# EAGLE design MITCH_2021-0_SHIELD (EAGLE 9.6.2)
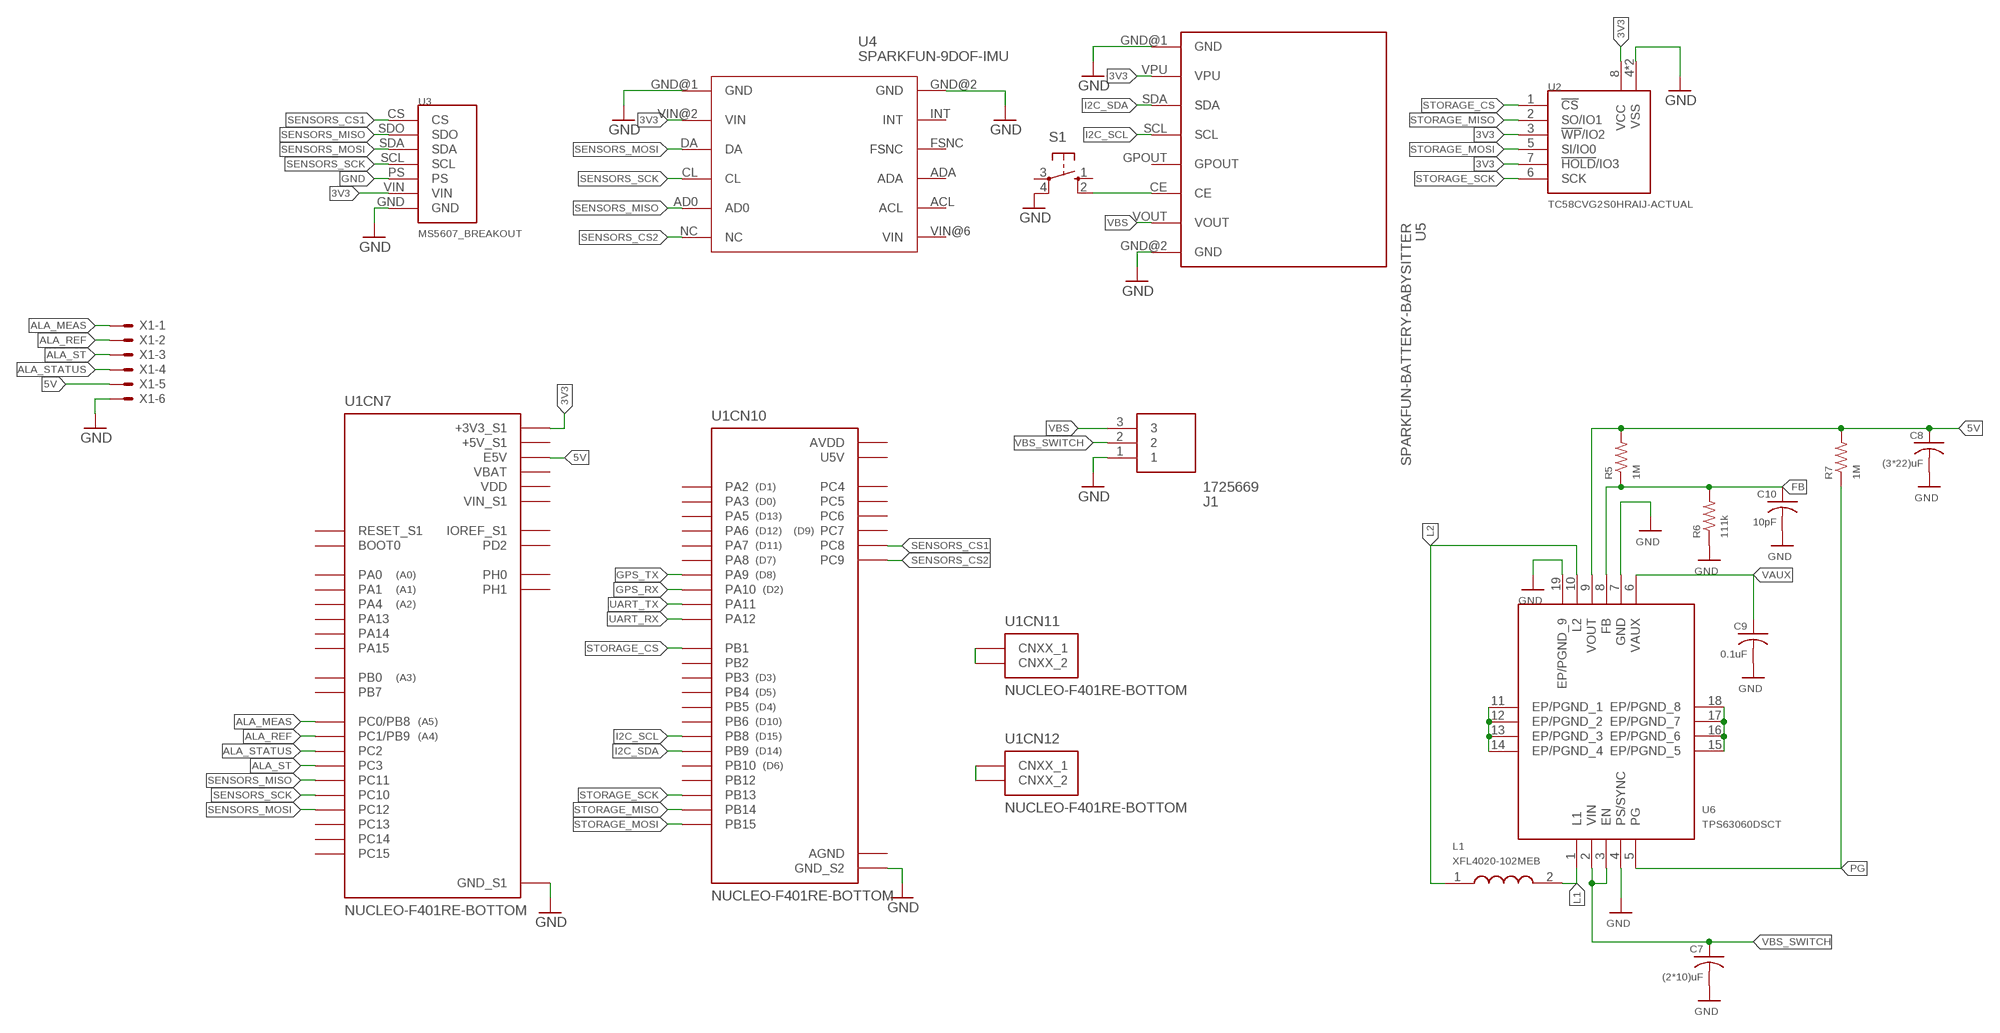
[diagram p0: schematic, sheet 1]

## Parts
C7  (2*10)uF  C-USC0805  [C0805]
C8  (3*22)uF  C-USC0805  [C0805]
C9  0.1uF  C-USC0805  [C0805]
C10  10pF  C-USC0805  [C0805]
J1  1725669  [1725669]
L1  XFL4020-102MEB  [XFL4020102MEB]
R5  1M  R-US_R0805  [R0805]
R6  111k  R-US_R0805  [R0805]
R7  1M  R-US_R0805  [R0805]
S1  10-XX  [B3F-10XX]
U1  NUCLEO-F401RE-BOTTOM  [ST_NUCLEO-F401RE_BOTTOM]
U2  TC58CVG2S0HRAIJ-ACTUAL  [COMPUTER2_SON127P800X600X80-9T350X440N]
U3  MS5607_BREAKOUT  [MS5607_BREAKOUT]
U4  SPARKFUN-9DOF-IMU  [SPARKFUN-9DOF-IMU1]
U5  SPARKFUN-BATTERY-BABYSITTER  [SPARKFUN-BATTERY-BABYSITTER]
U6  TPS63060DSCT  [TPS63060DSCT]
X1  22-23-2061  [22-23-2061]

## Nets
3V3: U1.CN7_16(CN7:+3V3_S1) U2.3(!WP!/IO2) U2.7(!HOLD!/IO3) U2.8(VCC) U3.VIN U4.VIN@2(VIN) U5.VPU
5V: C8.1 R5.2 R7.2 U1.CN7_6(CN7:E5V) U6.9(VOUT) X1.5
ALA_MEAS: U1.CN7_38(CN7:PC0/PB8) X1.1
ALA_REF: U1.CN7_36(CN7:PC1/PB9) X1.2
ALA_ST: U1.CN7_37(CN7:PC3) X1.3
ALA_STATUS: U1.CN7_35(CN7:PC2) X1.4
FB: C10.1 R5.1 R6.2 U6.8(FB)
GND: C7.2 C8.2 C9.2 C10.2 J1.1 R6.1 S1.4(P1) U1.CN7_8(CN7:GND_S1) U1.CN7_19(CN7:GND_S1) U1.CN7_20(CN7:GND_S1) U1.CN7_22(CN7:GND_S1) U1.CN10_9(CN10:GND_S2) U1.CN10_20(CN10:GND_S2) U2.4(VSS) U2.9(VSS) U3.GND U3.PS U4.GND@1(GND) U4.GND@2(GND) U5.GND@1(GND) U5.GND@2(GND) U6.4(PS/SYNC) U6.7(GND) U6.11(EP/PGND_1) U6.12(EP/PGND_2) U6.13(EP/PGND_3) U6.14(EP/PGND_4) U6.15(EP/PGND_5) U6.16(EP/PGND_6) U6.17(EP/PGND_7) U6.18(EP/PGND_8) U6.19(EP/PGND_9) X1.6
GPS_RX: U1.CN10_33(CN10:PA10)
GPS_TX: U1.CN10_21(CN10:PA9)
I2C_SCL: U1.CN10_3(CN10:PB8) U5.SCL
I2C_SDA: U1.CN10_5(CN10:PB9) U5.SDA
L1: L1.2 U6.1(L1)
L2: L1.1 U6.10(L2)
N$1: U1.CN12_1(CN12:CNXX_1) U1.CN12_2(CN12:CNXX_2)
N$3: U1.CN11_1(CN11:CNXX_1) U1.CN11_2(CN11:CNXX_2)
N$4: S1.2(S1) U5.CE
PG: R7.1 U6.5(PG)
SENSORS_CS1: U1.CN10_2(CN10:PC8) U3.CS
SENSORS_CS2: U1.CN10_1(CN10:PC9) U4.NC
SENSORS_MISO: U1.CN7_2(CN7:PC11) U3.SDO U4.AD0
SENSORS_MOSI: U1.CN7_3(CN7:PC12) U3.SDA U4.DA
SENSORS_SCK: U1.CN7_1(CN7:PC10) U3.SCL U4.CL
STORAGE_CS: U1.CN10_24(CN10:PB1) U2.1(!CS!)
STORAGE_MISO: U1.CN10_28(CN10:PB14) U2.2(SO/IO1)
STORAGE_MOSI: U1.CN10_26(CN10:PB15) U2.5(SI/IO0)
STORAGE_SCK: U1.CN10_30(CN10:PB13) U2.6(SCK)
UART_RX: U1.CN10_12(CN10:PA12)
UART_TX: U1.CN10_14(CN10:PA11)
VAUX: C9.1 U6.6(VAUX)
VBS: J1.3 U5.VOUT
VBS_SWITCH: C7.1 J1.2 U6.2(VIN) U6.3(EN)
Unconnected: S1.1(S) S1.3(P) U1.CN7_4(CN7:PD2) U1.CN7_7(CN7:BOOT0) U1.CN7_12(CN7:IOREF_S1) U1.CN7_13(CN7:PA13) U1.CN7_14(CN7:RESET_S1) U1.CN7_15(CN7:PA14) U1.CN7_17(CN7:PA15) U1.CN7_21(CN7:PB7) U1.CN7_23(CN7:PC13) U1.CN7_25(CN7:PC14) U1.CN7_27(CN7:PC15) U1.CN7_28(CN7:PA0) U1.CN7_29(CN7:PH0) U1.CN7_30(CN7:PA1) U1.CN7_31(CN7:PH1) U1.CN7_32(CN7:PA4) U1.CN7_34(CN7:PB0) U1.CN10_4(CN10:PC6) U1.CN10_6(CN10:PC5) U1.CN10_11(CN10:PA5) U1.CN10_13(CN10:PA6) U1.CN10_15(CN10:PA7) U1.CN10_16(CN10:PB12) U1.CN10_17(CN10:PB6) U1.CN10_19(CN10:PC7) U1.CN10_22(CN10:PB2) U1.CN10_23(CN10:PA8) U1.CN10_25(CN10:PB10) U1.CN10_27(CN10:PB4) U1.CN10_29(CN10:PB5) U1.CN10_31(CN10:PB3) U1.CN10_34(CN10:PC4) U1.CN10_35(CN10:PA2) U1.CN10_37(CN10:PA3) U4.ACL U4.ADA U4.FSNC U4.INT U4.VIN@6(VIN) U5.GPOUT

## Power pins joined to a net without a drawn wire
+5V_S1: U1.CN7_18(CN7:+5V_S1)
AGND: U1.CN10_32(CN10:AGND)
AVDD: U1.CN10_7(CN10:AVDD)
U5V: U1.CN10_8(CN10:U5V)
VBAT: U1.CN7_33(CN7:VBAT)
VDD: U1.CN7_5(CN7:VDD)
VIN_S1: U1.CN7_24(CN7:VIN_S1)

## Library data of the parts
C7-C10 = rcl:C-US: CAPACITOR, American symbol; SPICEPREFIX: C
J1 = SamacSys_Parts:1725669: 3 way PCB vertical mount terminal,2.54mm 3 way PCB vertical mount terminal,2.54mm Source: Datasheet <https://www.phoenixcontact.com/online/portal/gb?uri=pxc-oc-itemdetail:pid=1725669&library=gben&tab=1>; DESCRIPTION: 3 way PCB vertical mount terminal,2.54mm 3 way PCB vertical mount terminal,2.54mm; HEIGHT: 8.5mm; MANUFACTURER_NAME: Phoenix Contact; MANUFACTURER_PART_NUMBER: 1725669; MOUSER_PART_NUMBER: 651-1725669; MOUSER_PRICE-STOCK: https://www.mouser.co.uk/ProductDetail/Phoenix-Contact/1725669/?qs=A%2FKWGUWTCZjmkTL0Oe91ew%3D%3D
L1 = SamacSys_Parts:XFL4020-102MEB: 1 ELEMENT, 1 uH, METAL COMPOSITE-CORE, GENERAL PURPOSE INDUCTOR, SMD Source: Datasheet <https://www.coilcraft.com/getmedia/50632d43-da1b-4cdb-8ab4-3029cab51df3/xfl4020.pdf>; DESCRIPTION: 1 ELEMENT, 1 uH, METAL COMPOSITE-CORE, GENERAL PURPOSE INDUCTOR, SMD; HEIGHT: 2.1mm; MANUFACTURER_NAME: COILCRAFT; MANUFACTURER_PART_NUMBER: XFL4020-102MEB; MOUSER_PART_NUMBER: 994-XFL4020-102MEB; MOUSER_PRICE-STOCK: https://www.mouser.co.uk/ProductDetail/Coilcraft/XFL4020-102MEB/?qs=VJjuEbE9QBMkuCkoKl%252B%2FQw%3D%3D
R5-R7 = rcl:R-US_: RESISTOR, American symbol; SPICEPREFIX: R
S1 = switch-omron:10-XX: OMRON SWITCH; MPN: B3F-1000; OC_FARNELL: 176432; OC_NEWARK: 36M3542
U1 = MITCH Shield:NUCLEO-F401RE-BOTTOM: STM32 Nucleo-64 development board with STM32F401RET6 MCU, supports Arduino and ST morpho connectivity Check prices <https://pricing.snapeda.com/parts/NUCLEO-F401RE/STMicroelectronics/view-part?ref=eda>; AVAILABILITY: Warning; DESCRIPTION: STM32F401RE, mbed-Enabled Development Nucleo-64 STM32F4 ARM® Cortex®-M4 MCU 32-Bit Embedded Evaluation Board; MF: STMicroelectronics; MP: NUCLEO-F401RE; PACKAGE: None; PRICE: None; PURCHASE-URL: https://pricing.snapeda.com/search/part/NUCLEO-F401RE/?ref=eda
U2 = MITCH Shield:TC58CVG2S0HRAIJ-ACTUAL
U3 = MITCH Shield:MS5607_BREAKOUT
U4 = MITCH Shield:SPARKFUN-9DOF-IMU
U5 = MITCH Shield:SPARKFUN-BATTERY-BABYSITTER
U6 = SamacSys_Parts:TPS63060DSCT: Switching Voltage Regulators 2.5-12Vin,2.25A Sw Crnt Limit Source: Datasheet <https://www.ti.com/lit/ds/symlink/tps63060.pdf?ts=1601363493602&ref_url=https%3A%2F%2Fwww.ti.com%2Fproduct%2FTPS63060>; DESCRIPTION: Switching Voltage Regulators 2.5-12Vin,2.25A Sw Crnt Limit; HEIGHT: 0.8mm; MANUFACTURER_NAME: Texas Instruments; MANUFACTURER_PART_NUMBER: TPS63060DSCT; MOUSER_PART_NUMBER: 595-TPS63060DSCT; MOUSER_PRICE-STOCK: https://www.mouser.co.uk/ProductDetail/Texas-Instruments/TPS63060DSCT/?qs=3jfYfyvUSwDkzbf98IOP5g%3D%3D
X1 = con-molex:22-23-2061: .100" (2.54mm) Center Header - 6 Pin; MF: MOLEX; MPN: 22-23-2061; OC_FARNELL: 1462922; OC_NEWARK: 27C1933

## Board
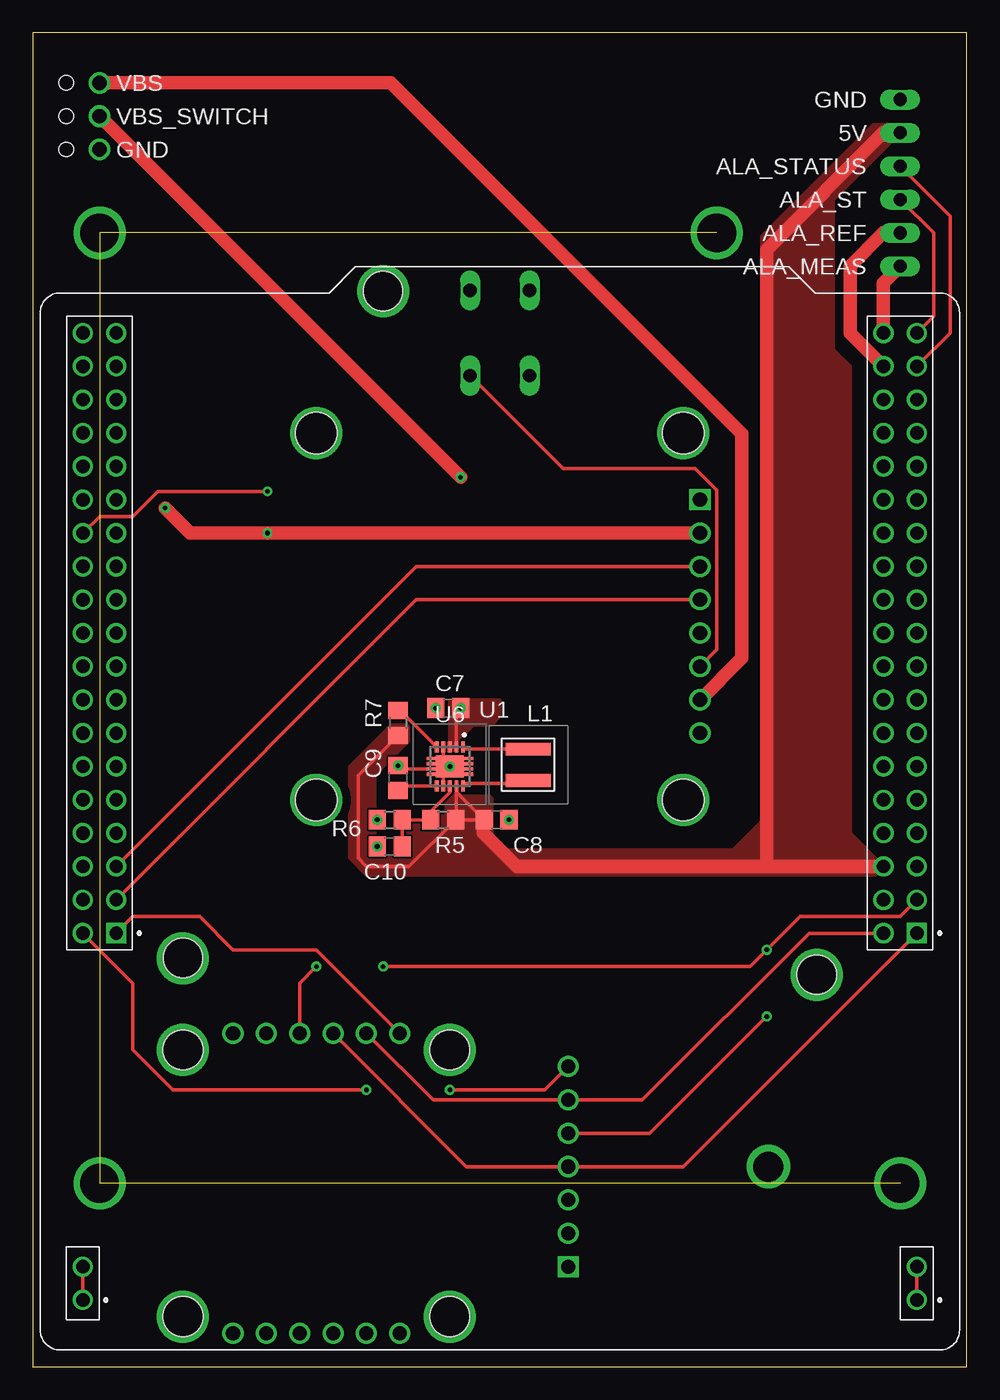
[diagram p1: board, top side]
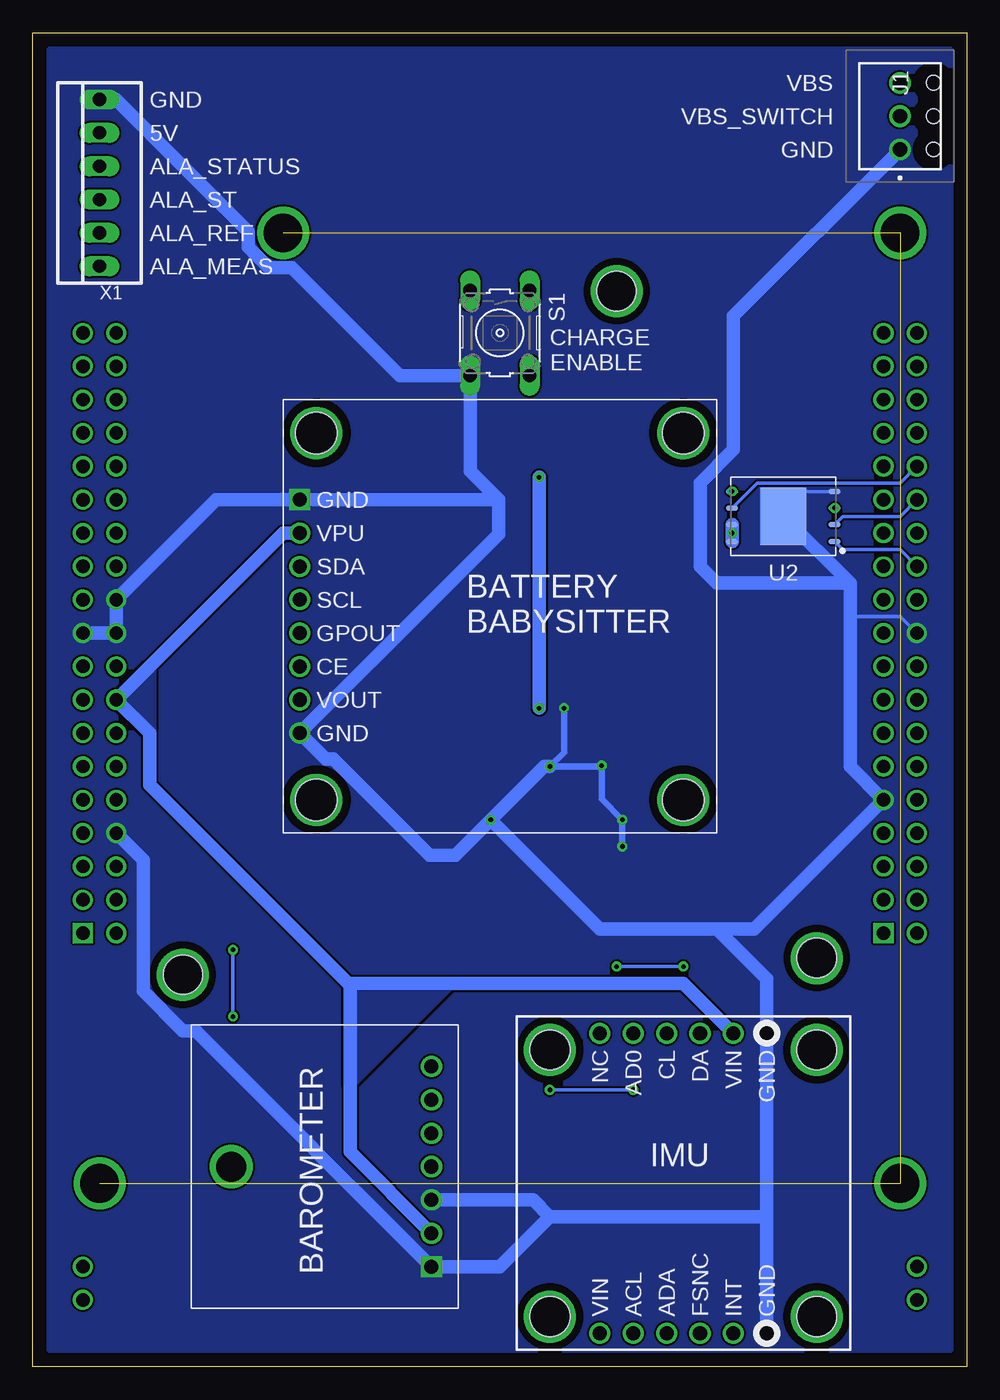
[diagram p2: board, bottom side, seen from below]

Size 71.12 x 101.6 mm. Coordinates in mm from the lower left corner, seen from the top.
Outline: 71.12,0 71.12,101.6 0,101.6 0,0 71.12,0
Copper layers (1*16): Top 0.035mm / dielectric 1.5mm / Bottom 0.035mm
Design rules "default": minimum track width 6mil, minimum drill 0.35mm, track to track 6mil, track to pad 6mil, pad to pad 6mil, via to via 6mil, smd to smd 6mil, copper to edge 40mil, drill to drill 6mil, minimum pad ring 10mil, minimum via ring 8mil, stop-mask expansion 4mil, vias tented up to drill 0mil, thermal gap 10mil

### Footprints (pad centres in the part's own frame; a part is rotated, then mirrored left to right if it is on the bottom)
C0805 = smd 1.3 x 1.5: 1 -0.95,0; 2 0.95,0
1725669 = drill 1.1 pad 1.65: 1 0,0; 2 2.54,0; 3 5.08,0 | hole 1.1: 0,-2.54; 2.54,-2.54; 5.08,-2.54
XFL4020102MEB = smd 0.98 x 3.4: 1 -1.185,0; 2 1.185,0
R0805 = smd 1.3 x 1.5: 1 -0.95,0; 2 0.95,0
B3F-10XX = drill 1.016 long: 1 -3.251,2.261; 2 3.251,2.261; 3 -3.251,-2.261; 4 3.251,-2.261
ST_NUCLEO-F401RE_BOTTOM = drill 1.02 square: CN7_1 -31.75,10.16; CN10_1 29.21,10.16 | drill 1.02: CN7_2 -29.21,10.16; CN7_3 -31.75,7.62; CN7_4 -29.21,7.62; CN7_5 -31.75,5.08; CN7_6 -29.21,5.08; CN7_7 -31.75,2.54; CN7_8 -29.21,2.54; CN7_9 -31.75,0; CN7_10 -29.21,0; CN7_11 -31.75,-2.54; CN7_12 -29.21,-2.54; CN7_13 -31.75,-5.08; CN7_14 -29.21,-5.08; CN7_15 -31.75,-7.62; CN7_16 -29.21,-7.62; CN7_17 -31.75,-10.16; CN7_18 -29.21,-10.16; CN7_19 -31.75,-12.7; CN7_20 -29.21,-12.7; CN7_21 -31.75,-15.24; CN7_22 -29.21,-15.24; CN7_23 -31.75,-17.78; CN7_24 -29.21,-17.78; CN7_25 -31.75,-20.32; CN7_26 -29.21,-20.32; CN7_27 -31.75,-22.86; CN7_28 -29.21,-22.86; CN7_29 -31.75,-25.4; CN7_30 -29.21,-25.4; CN7_31 -31.75,-27.94; CN7_32 -29.21,-27.94; CN7_33 -31.75,-30.48; CN7_34 -29.21,-30.48; CN7_35 -31.75,-33.02; CN7_36 -29.21,-33.02; CN7_37 -31.75,-35.56; CN7_38 -29.21,-35.56; CN10_2 31.75,10.16; CN10_3 29.21,7.62; CN10_4 31.75,7.62; CN10_5 29.21,5.08; CN10_6 31.75,5.08; CN10_7 29.21,2.54; CN10_8 31.75,2.54; CN10_9 29.21,0; CN10_10 31.75,0; CN10_11 29.21,-2.54; CN10_12 31.75,-2.54; CN10_13 29.21,-5.08; CN10_14 31.75,-5.08; CN10_15 29.21,-7.62; CN10_16 31.75,-7.62; CN10_17 29.21,-10.16; CN10_18 31.75,-10.16; CN10_19 29.21,-12.7; CN10_20 31.75,-12.7; CN10_21 29.21,-15.24; CN10_22 31.75,-15.24; CN10_23 29.21,-17.78; CN10_24 31.75,-17.78; CN10_25 29.21,-20.32; CN10_26 31.75,-20.32; CN10_27 29.21,-22.86; CN10_28 31.75,-22.86; CN10_29 29.21,-25.4; CN10_30 31.75,-25.4; CN10_31 29.21,-27.94; CN10_32 31.75,-27.94; CN10_33 29.21,-30.48; CN10_34 31.75,-30.48; CN10_35 29.21,-33.02; CN10_36 31.75,-33.02; CN10_37 29.21,-35.56; CN10_38 31.75,-35.56; CN11_1 31.75,38.1; CN11_2 31.75,35.56; CN12_1 -31.75,38.1; CN12_2 -31.75,35.56 | hole 3: 8.89,-38.75; 24.13,12.05; -24.13,13.32
COMPUTER2_SON127P800X600X80-9T350X440N = smd 0.911 x 0.42: 1 -3.901,1.905; 2 -3.901,0.635; 3 -3.901,-0.635; 4 -3.901,-1.905; 5 3.901,-1.905; 6 3.901,-0.635; 7 3.901,0.635; 8 3.901,1.905 | smd 3.5 x 4.4: 9 0,0
MS5607_BREAKOUT = drill 1.07: CS 18.415,2.032; PS 8.255,2.032; SCL 10.795,2.032; SDA 13.335,2.032; SDO 15.875,2.032; VIN 5.715,2.032 | drill 1.07 square: GND 3.175,2.032 | drill 2.286: SCREW 10.795,17.272
SPARKFUN-9DOF-IMU1 = drill 1.07: ACL 16.51,24.13; AD0 16.51,1.27; ADA 13.97,24.13; CL 13.97,1.27; DA 11.43,1.27; FSNC 11.43,24.13; GND@1 6.35,1.27; GND@2 6.35,24.13; INT 8.89,24.13; NC 19.05,1.27; VIN@2 8.89,1.27; VIN@6 19.05,24.13 | hole 3.048: 22.86,22.86; 22.86,2.54; 2.54,2.54; 2.54,22.86
SPARKFUN-BATTERY-BABYSITTER = drill 1.07: CE 3.81,-15.24; GND@2 8.89,-15.24; GPOUT 1.27,-15.24; SCL -1.27,-15.24; SDA -3.81,-15.24; VOUT 6.35,-15.24; VPU -6.35,-15.24 | drill 1.07 square: GND@1 -8.89,-15.24 | hole 3.175: -13.97,-13.97; 13.97,-13.97; 13.97,13.97; -13.97,13.97
TPS63060DSCT = smd 0.28 x 0.85: 1 -1,-1.475; 2 -0.5,-1.475; 3 0,-1.475; 4 0.5,-1.475; 5 1,-1.475; 6 1,1.475; 7 0.5,1.475; 8 0,1.475; 9 -0.5,1.475; 10 -1,1.475 | smd 0.7 x 0.25: 11 -1.425,0.6; 12 -1.425,0.2; 13 -1.425,-0.2; 14 -1.425,-0.6; 15 1.425,-0.6; 16 1.425,-0.2; 17 1.425,0.2; 18 1.425,0.6 | smd 2.15 x 1.7: 19 0,0
22-23-2061 = drill 1 long: 1 -6.35,0; 2 -3.81,0; 3 -1.27,0; 4 1.27,0; 5 3.81,0; 6 6.35,0

### Placement (x,y rotation side)
C7  31.62,50.17 180 top
C8  35.31,41.66 0 top
C9  27.81,44.83 90 top
C10  27.18,39.62 180 top
J1  5.08,92.71 90 bottom
L1  37.72,45.85 90 top
R5  31.24,41.66 0 top
R6  27.18,41.66 0 top
R7  27.81,49.02 270 top
S1  35.56,78.74 270 bottom
U1  35.56,43.18 180 top
U2  13.97,64.77 180 bottom
U3  38.73,4.45 90 bottom
U4  8.89,26.67 180 bottom
U5  35.56,57.15 270 bottom
U6  31.75,45.72 180 top
X1  66.04,90.17 90 bottom

### Tracks (layer width: path | path; a pad name or v marks a point on that pad's centre or on a via)
3V3  (via drill 0.35)
  Top 0.254: 17.78,63.5 v17.87,63.5
  Top 1.016: U2.3 11.97,63.5 17.78,63.5 | v17.87,63.5 U5.VPU
  Bottom 1.016: U5.VPU 52.07,63.5 U1.CN7_16 62.23,48.26 62.23,44.32 46.97,29.06 | U2.8 v17.87,63.5 U2.7 | 46.97,29.06 46.97,16.36 U3.VIN | 46.97,29.06 46.82,29.21 21.59,29.21 U4.VIN@2
  other vias: 10.07,65.41
  pour Bottom (no thermals): 62.23,48.26 62.23,53.34 64.77,50.8
  pour Bottom: 46.99,29.21 46.99,21.59 39.37,29.21
5V
  Top 0.254: 32.25,41.71 U6.9 32.25,43.76 C8.1 32.31,41.66 32.25,41.71 | 32.25,41.71 R5.2 28.64,38.1 25.4,38.1 24.77,38.73 24.77,45.02 R7.2
  Top 1.016: C8.1 34.29,41.59 34.29,40.64 36.83,38.1 55.88,38.1 | 55.88,38.1 U1.CN7_6 | 55.88,38.1 55.88,85.09 64.77,93.98 X1.5
  pour Top (no thermals): 32.26,43.82 32.64,43.43 34.8,43.43 34.93,43.31 34.93,40.26 34.8,40.13 31.62,40.13 31.5,40.26 31.5,42.93 32.26,43.69
  pour Top (no thermals): 33.02,40.64 32.39,40.64 29.21,37.47 25.4,37.47 24.13,38.73 24.13,45.72 27.3,48.9 28.58,48.9 28.58,47.62 26.04,45.09 26.04,39.37 26.67,38.73 27.94,38.73 28.58,39.37 28.58,41.91 32.39,41.91 33.02,41.28
  pour Top (no thermals): 28.45,37.47 64.14,37.47 64.77,38.1 62.23,40.64 62.23,76.2 60.96,77.47 60.96,88.9 66.04,93.98 66.04,94.36 65.79,94.62 64.01,94.62 55.5,86.11 55.5,41.53 53.34,39.37 35.56,39.37 34.29,40.64 31.62,40.64
ALA_MEAS
  Top 1.016: U1.CN7_38 64.77,82.55 X1.1
ALA_REF
  Top 1.016: U1.CN7_36 62.23,78.74 62.23,83.82 64.77,86.36 X1.2
ALA_ST
  Top 0.254: U1.CN7_37 68.58,80.01 68.58,86.36 X1.3
ALA_STATUS
  Top 0.254: U1.CN7_35 69.85,78.74 69.85,87.63 X1.4
FB
  Top 0.254: U6.8 31.75,43.75 30.29,42.29 R5.1 R6.2 C10.1
GND  (via drill 0.35)
  Top 0.254: C9.2 28.07,45.52 U6.17 31.55,45.52 | U6.4 31.25,46.22 U6.19 | U6.15 31.15,46.32 U6.19 | U6.16 31.55,45.92 U6.19 | U6.18 31.15,45.12 31.25,45.22 | U6.12 31.95,45.52 U6.19 | U6.11 32.35,45.12 U6.19 | U6.13 31.95,45.92 | 31.95,45.92 U6.19 | U6.14 32.35,46.32 31.95,45.92 | U6.19 31.55,45.52 | U6.7 31.25,45.22 | 31.25,45.22 31.55,45.52
  Bottom 0.152: X1.6 64.77,96.52
  Bottom 0.254: U2.4 13.97,66.67 U2.9 | U1.CN10_20 5.08,57.15 8.89,57.15 | 59.69,25.58 59.69,26.12 62.33,28.77 62.33,38.2 U1.CN7_8 | 40.64,7.62 U3.GND
  Bottom 0.508: C10.2 R6.1 27.81,43.24 C9.2 27.87,45.72 U6.19 30.67,46.8 C7.2
  Bottom 1.016: U1.CN7_19 U1.CN7_20 U1.CN7_22 57.15,66.04 U5.GND@1 35.65,66.04 | C8.2 38.96,38.96 40.91,38.96 48.24,46.29 48.83,46.29 U5.GND@2 35.65,63.41 35.65,66.04 | C8.2 27.94,33.34 19.05,33.34 | 19.05,33.34 16.19,33.34 U1.CN10_9 8.89,45.72 8.89,57.15 8.89,59.69 | 8.89,59.69 U2.9 | 8.89,59.69 19.05,59.69 20.32,60.96 20.32,67.31 17.78,69.85 17.78,80.01 J1.1 | U6.19 32.19,45.72 C8.2 | U4.GND@2 15.24,11.43 | 15.24,11.43 U4.GND@1 15.24,29.53 19.05,33.34 | 35.65,66.04 37.82,68.21 S1.4 43.18,75.49 51.41,83.72 53.16,83.72 54.71,85.27 54.71,86.46 64.77,96.52 | 15.24,11.43 31.75,11.43 | U3.PS 33.02,12.7 31.75,11.43 | 31.75,11.43 35.56,7.62 40.64,7.62 | U1.CN7_8 62.71,38.58 62.71,28.61 59.69,25.58 58.73,25.58 U3.GND
  other vias: 31.75,45.72 27.81,45.78 26.23,41.66 26.23,39.62 36.26,41.66 30.67,50.17
  pour Bottom: 22.86,36.83 40.64,36.83 41.91,38.1 41.91,50.8 40.64,52.07 22.86,52.07 21.59,50.8 21.59,38.1
  pour Bottom (rank 2, no thermals): 1.27,100.33 1.27,1.27 69.85,1.27 69.85,100.33
I2C_SCL
  Top 0.254: U5.SCL 29.21,58.42 U1.CN10_3
I2C_SDA
  Top 0.254: U1.CN10_5 29.21,60.96 U5.SDA
L1
  Top 0.254: U6.1 32.91,47.03 L1.2
L2
  Top 0.254: U6.10 32.91,44.41 37.47,44.41 L1.1
N10  (via drill 2.95)  (3 unrouted)
  other vias: 5.08,13.97 66.04,13.97 52.07,86.36 5.08,86.36
N$1
  Top 0.254: U1.CN12_1 U1.CN12_2
N$2  (via drill 2.95)
  other vias: 11.43,24.13
N$3
  Top 0.254: U1.CN11_1 U1.CN11_2
N$4
  Top 0.254: U5.CE 52.07,54.61 52.07,66.77 50.45,68.39 40.4,68.39 S1.2
N$5  (via drill 2.95)
  other vias: 11.43,3.81
N$6  (via drill 2.95)
  other vias: 31.75,3.81
N$7  (via drill 2.95)
  other vias: 31.75,24.13
N$8  (via drill 2.95)
  other vias: 11.43,31.12
N$9  (via drill 2.95)
  other vias: 21.59,43.18
N$10  (via drill 2.95)
  other vias: 49.53,43.18
N$11  (via drill 2.95)
  other vias: 59.69,29.85
N$12  (via drill 2.95)
  other vias: 21.59,71.12
N$13  (via drill 2.95)
  other vias: 49.53,71.12
N$14  (via drill 2.95)
  other vias: 26.67,81.92
PG
  Top 0.254: U6.5 27.97,49.97 R7.1
SENSORS_CS1  (via drill 0.35)
  Top 0.254: U1.CN10_2 7.62,29.21 7.62,24.13 10.67,21.08 v25.4,21.08 | v31.75,21.08 38.99,21.08 U3.CS
  Bottom 0.254: v31.75,21.08 v25.4,21.08
SENSORS_CS2
  Top 0.254: U1.CN10_1 7.62,34.29 12.7,34.29 15.24,31.75 21.59,31.75 U4.NC
SENSORS_MISO
  Top 0.254: U1.CN7_2 59.11,33.02 46.41,20.32 U3.SDO 30.48,20.32 U4.AD0
SENSORS_MOSI  (via drill 0.35)
  Top 0.254: U1.CN7_3 66.04,34.29 58.42,34.29 v55.88,31.75 54.61,30.48 v26.67,30.48 | U3.SDA 46.99,17.78 v55.88,26.67 | v21.59,30.48 20.32,29.21 U4.DA
  Bottom 0.254: v55.88,26.67 v55.88,31.75 | v26.67,30.48 v21.59,30.48
SENSORS_SCK
  Top 0.254: U1.CN7_1 49.53,15.24 U3.SCL 33.02,15.24 U4.CL
STORAGE_CS
  Bottom 0.254: U2.1 9.43,62.23 5.08,62.23 U1.CN10_24
STORAGE_MISO
  Bottom 0.254: U1.CN10_28 5.08,64.77 9.43,64.77 U2.2
STORAGE_MOSI  (via drill 0.35)
  Top 0.254: U1.CN10_26 5.08,64.77 7.62,64.77 9.53,66.67 U2.5
  other vias: 17.87,66.67
STORAGE_SCK
  Bottom 0.254: U2.6 15.97,67.31 5.08,67.31 U1.CN10_30
VAUX
  Top 0.254: U6.6 28.18,44.25 C9.1
VBS
  Top 1.016: U5.VOUT 53.98,53.98 53.98,71.08 27.26,97.79 J1.3
VBS_SWITCH  (via drill 0.35)
  Top 0.254: C7.1 32.25,49.84 U6.2 U6.3
  Top 1.016: J1.2 v32.57,67.76
  Bottom 1.016: C7.1 v32.57,67.76
  other vias: 32.57,50.17
  pour Top (no thermals): 31.75,46.99 31.75,50.8 35.56,50.8 35.56,49.53 34.93,48.9 33.53,48.9 32.26,47.62 32.26,46.99

### Text on the board
tNames: VBS | GND | VBS_SWITCH | 5V | GND | ALA_STATUS | ALA_ST | ALA_REF | ALA_MEAS
bNames: VBS | GND | VBS_SWITCH | 5V | GND | ALA_STATUS | ALA_ST | ALA_REF | ALA_MEAS | CHARGE / ENABLE | BATTERY / BABYSITTER | BAROMETER | IMU